# EAGLE design E3-Touch_Sensor_v1 (EAGLE 7.7.0)
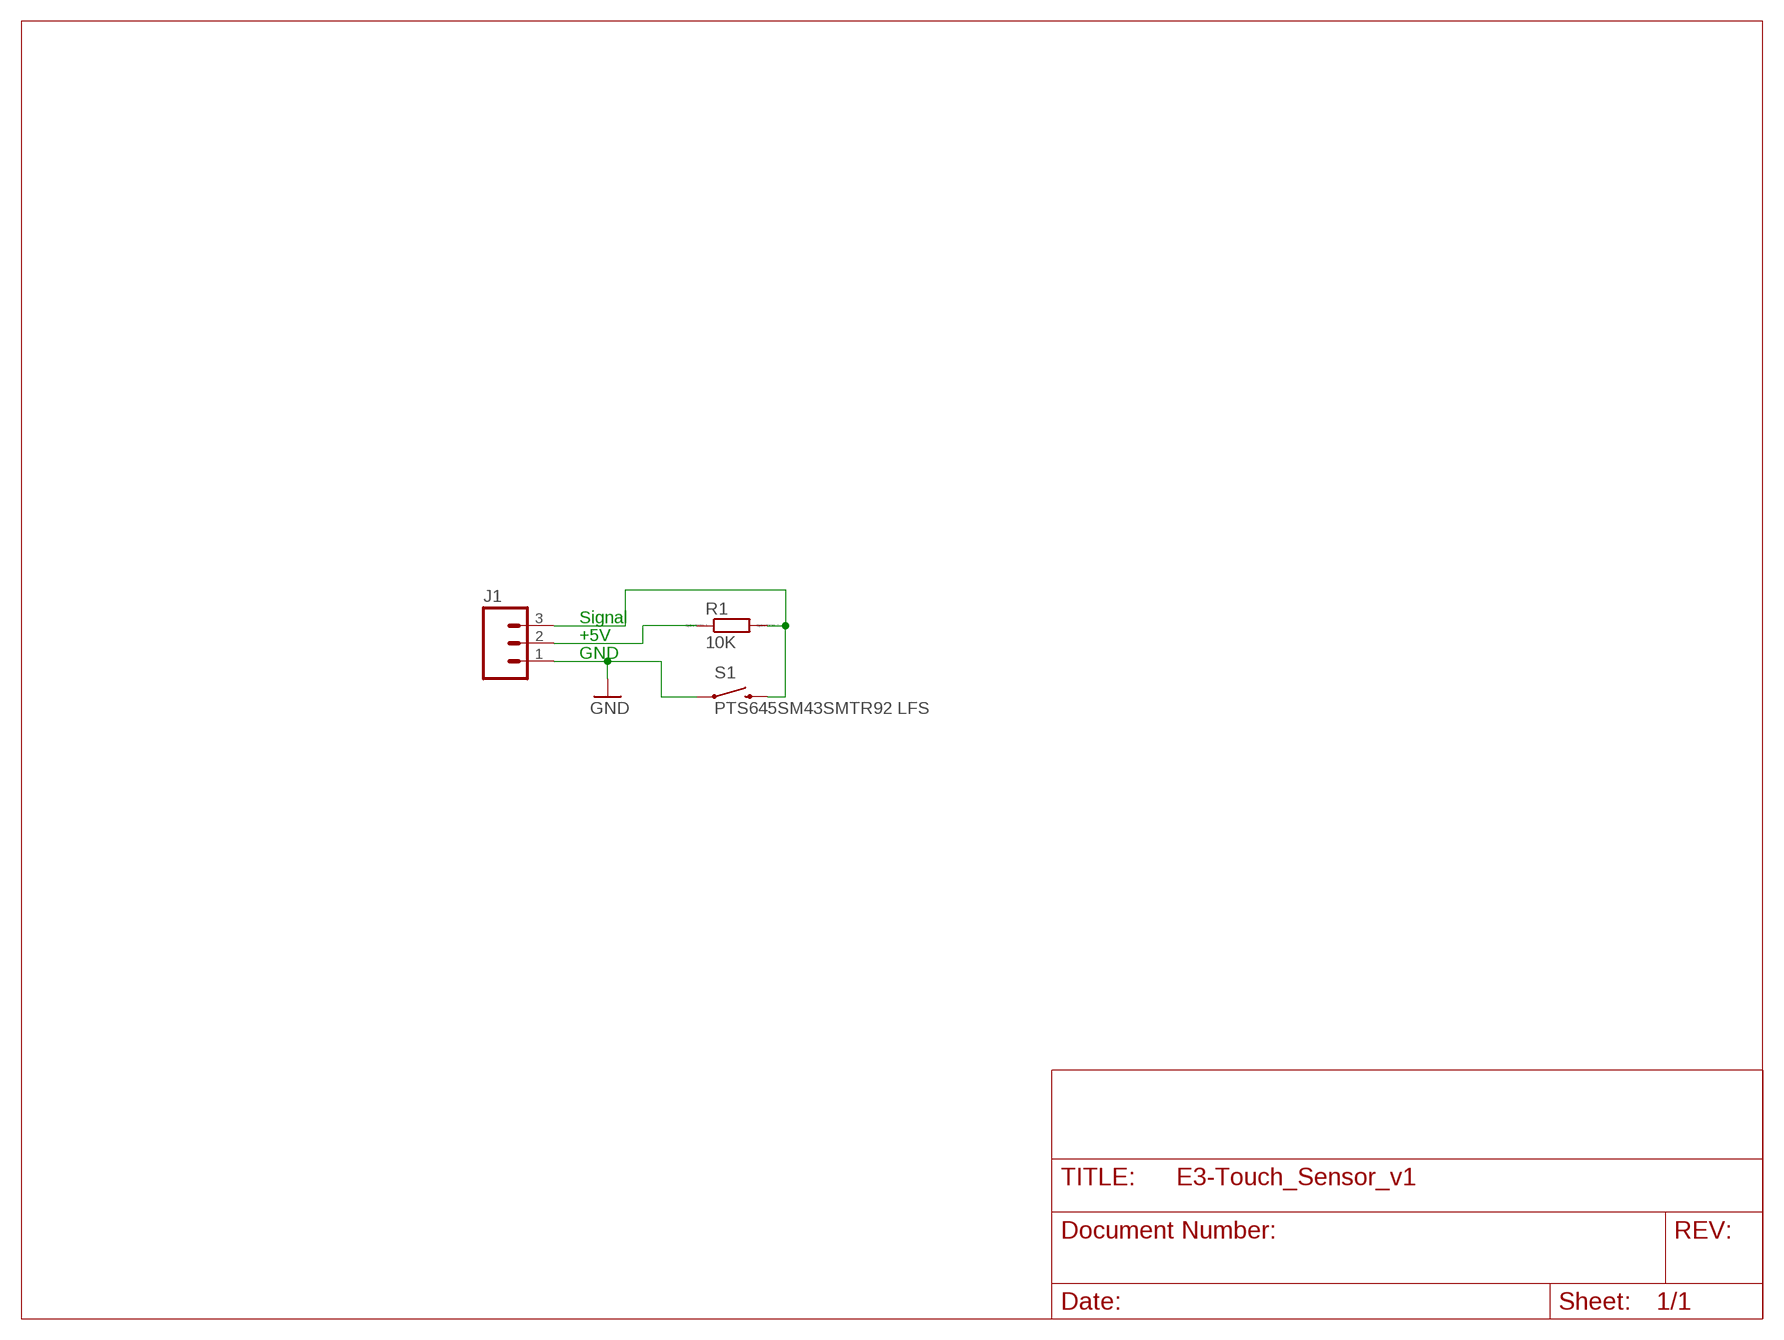
[diagram p0: schematic, sheet 1]

## Parts
J1  M03PTH  [1X03]
R1  10K  RR0603  [R0603]
S1  PTS645SM43SMTR92 LFS  SWITCH-MOMENTARY-2SMD-4  [TACTILE_SWITCH_TALL]

## Nets
GND: J1.1 S1.A2
N$2: J1.3 R1.2 S1.B2
N$3: J1.2 R1.1

## Notes on the sheet
- Signal
- +5V
- GND

## Library data of the parts
J1 = SparkFun-Connectors:M03: Header 3 Standard 3-pin 0.1" header. Use with straight break away headers (SKU : PRT-00116), right angle break away headers (PRT-00553), swiss pins (PRT-00743), machine pins (PRT-00117), and female headers (PRT-00115). Molex polarized connector foot print use with SKU : PRT-08232 with associated crimp pins and housings.
R1 = eagle-ltspice:R: RESISTOR, European symbol; SPICEMODEL: NONE; SPICEPREFIX: R
S1 = SparkFun-Electromechanical:SWITCH-MOMENTARY-2: Various NO switches- pushbuttons, reed, etc; PROD_ID: SWCH-11966

## Board
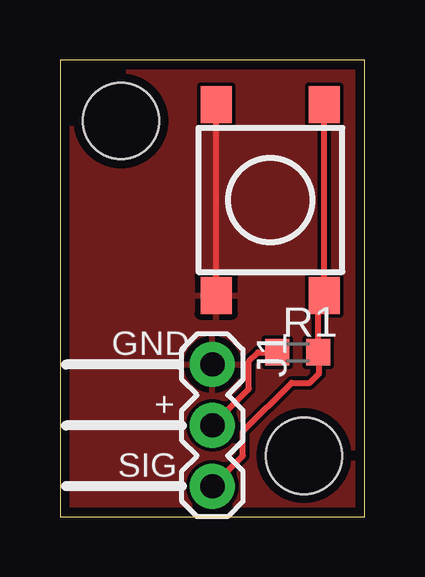
[diagram p1: board, top side]
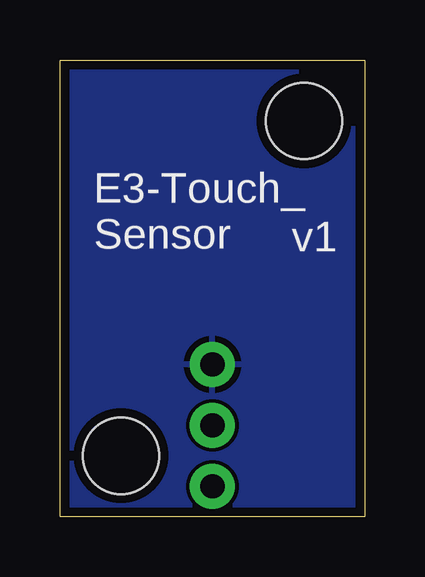
[diagram p2: board, bottom side, seen from below]

Size 12.7 x 19.05 mm. Coordinates in mm from the lower left corner, seen from the top.
Outline: 0,0 12.7,0 12.7,19.05 0,19.05 0,0
Copper layers (1*16): Top 0.0356mm / dielectric 1.5011mm / Bottom 0.0356mm
Design rules "oshpark-2layer-BPS": minimum track width 6mil, minimum drill 13mil, track to track 6mil, track to pad 6mil, pad to pad 6mil, via to via 6mil, smd to smd 6mil, copper to edge 15mil, drill to drill 6mil, minimum pad ring 7mil, minimum via ring 7mil, stop-mask expansion 2.5mil, vias tented up to drill 25mil, thermal gap 10mil
Holes 3.17 mm at 10.16,2.54 2.54,16.51

### Footprints (pad centres in the part's own frame; a part is rotated, then mirrored left to right if it is on the bottom)
1X03 = drill 1.016 pad 1.88: 1 0,0; 2 2.54,0; 3 5.08,0
R0603 = smd 1 x 1.1: 1 -0.85,0; 2 0.85,0
TACTILE_SWITCH_TALL = smd 1.55 x 1.3: A1 -3.975,-2.25; A2 3.975,-2.25; B1 -3.975,2.25; B2 3.975,2.25

### Placement (x,y rotation side)
J1  6.35,6.35 270 top
R1  9.91,6.86 0 top
S1  8.76,13.21 270 top

### Tracks (layer width: path | path; a pad name or v marks a point on that pad's centre or on a via)
GND
  Top 0.254: S1.A2 6.51,17.24 6.48,17.27
  pour Top: 0,1.27 0,19.05 12.7,19.05 12.7,0 0,0
  pour Bottom: 0,0 0,19.05 12.7,19.05 12.7,0
N$2
  Top 0.254: 11.05,17.14 11.01,17.11 S1.B2 10.76,8.98 R1.2 10.79,6.82 10.79,5.97 10.41,5.59 9.65,5.59 7.62,3.56 7.62,2.54 J1.3
N$3
  Top 0.254: J1.2 7.87,5.33 7.87,6.48 8.26,6.86 R1.1

### Text on the board
tPlace: GND | + | SIG
bPlace: v1 | E3-Touch_ / Sensor